# EAGLE design piHatMotorDriver (EAGLE 9.6.1)
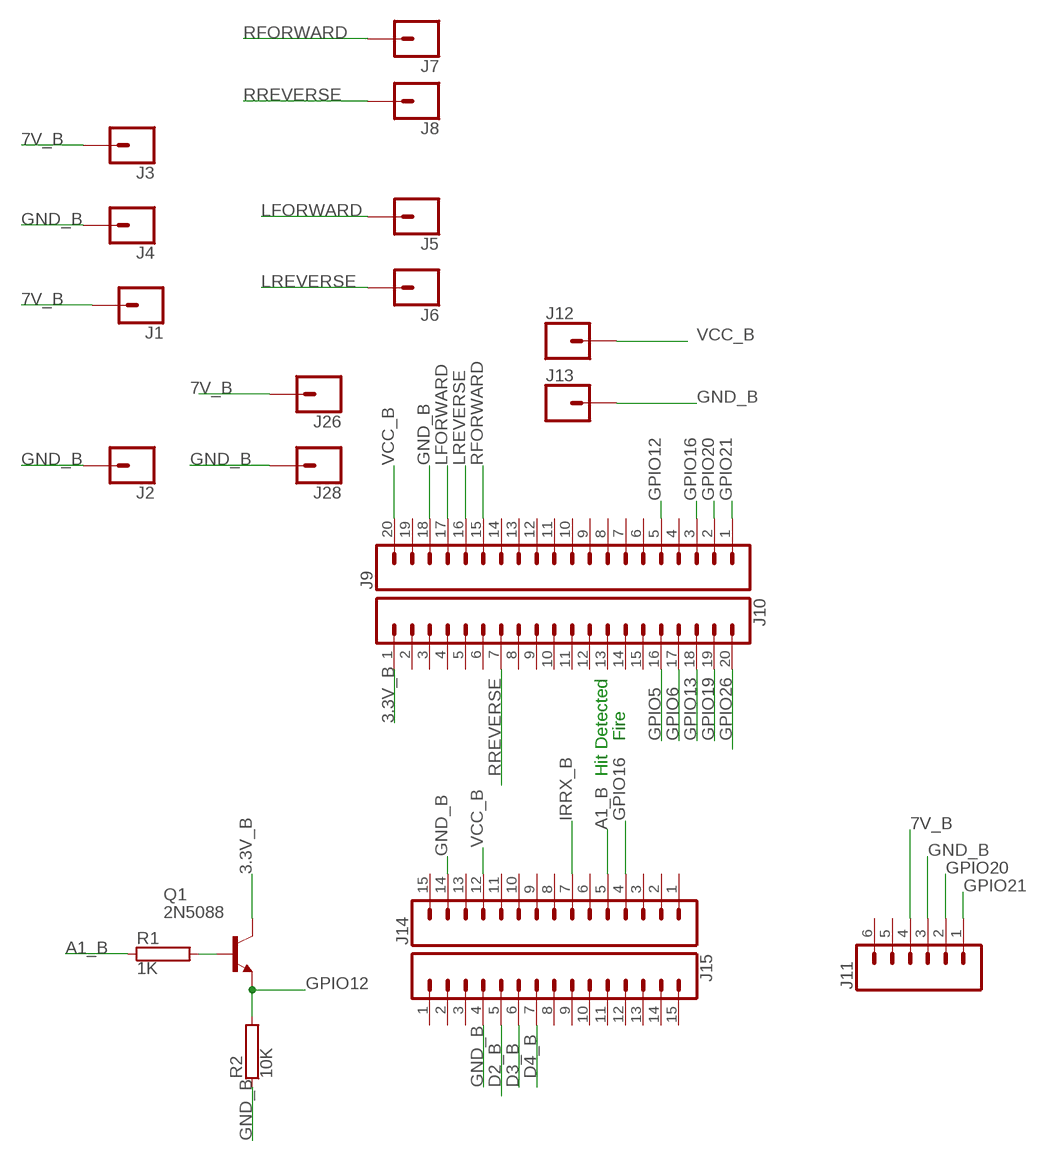
[diagram p0: schematic, sheet 1]

## Parts
J1  CONN_01  [1X01]
J2  CONN_01  [1X01]
J3  CONN_01  [1X01]
J4  CONN_01  [1X01]
J5  CONN_01  [1X01]
J6  CONN_01  [1X01]
J7  CONN_01  [1X01]
J8  CONN_01  [1X01]
J9  CONN_20  [1X20]
J10  CONN_20  [1X20]
J11  CONN_06SILK_FEMALE_PTH  [1X06]
J12  CONN_01  [1X01]
J13  CONN_01  [1X01]
J14  CONN_15  [1X15]
J15  CONN_15  [1X15]
J26  CONN_01  [1X01]
J28  CONN_01  [1X01]
Q1  2N5088  [TO92]
R1  1K  RCA0001  [CA0001]
R2  10K  RCA0001  [CA0001]

## Nets
3.3V_B: J10.1 Q1.1(C)
7V_B: J1.1 J3.1 J11.4 J26.1
A1_B: J14.5 R1.1
D2_B: J15.5
D3_B: J15.6
D4_B: J15.7
GND_B: J2.1 J4.1 J9.18 J11.3 J13.1 J14.14 J15.4 J28.1 R2.1
GPIO5: J10.16
GPIO6: J10.17
GPIO12: J9.5 Q1.3(E) R2.2
GPIO13: J10.18
GPIO16: J9.3 J14.4
GPIO19: J10.19
GPIO20: J9.2 J11.2
GPIO21: J9.1 J11.1
GPIO26: J10.20
IRRX_B: J14.7
LFORWARD: J5.1 J9.17
LREVERSE: J6.1 J9.16
N$1: Q1.2(B) R1.2
RFORWARD: J7.1 J9.15
RREVERSE: J8.1 J10.7
VCC_B: J9.20 J12.1 J14.12
Unconnected: J9.4 J9.6 J9.7 J9.8 J9.9 J9.10 J9.11 J9.12 J9.13 J9.14 J9.19 J10.2 J10.3 J10.4 J10.5 J10.6 J10.8 J10.9 J10.10 J10.11 J10.12 J10.13 J10.14 J10.15 J11.5 J11.6 J14.1 J14.2 J14.3 J14.6 J14.8 J14.9 J14.10 J14.11 J14.13 J14.15 J15.1 J15.2 J15.3 J15.8 J15.9 J15.10 J15.11 J15.12 J15.13 J15.14 J15.15

## Notes on the sheet
- Fire
- Hit Detected

## Library data of the parts
J1-J8 J12 J13 J26 J28 = SparkFun-Connectors:CONN_01: Single connection point. Often used as Generic Header-pin footprint for 0.1 inch spaced/style header connections On any of the 0.1 inch spaced packages, you can populate with these: Break Away Headers - Straight <https://www.sparkfun.com/products/116> (PRT-00116) Break Away Male Headers - Right Angle <https://www.sparkfun.com/products/553> (PRT-00553) Female Headers <https://www.sparkfun.com/products/115> (PRT-00115) Break Away Headers - Machine Pin <https://www.sparkfun.com/products/117> (PRT-00117) Break Away Female Headers - Swiss Machine Pin <https://www.sparkfun.com/products/743> (PRT-00743) This device is also useful as a general connection point to wire up your design to another part of your project. Our various solder wires solder well into these plated through hole pads. Hook-Up Wire - Assortment (Stranded, 22 AWG) <https://www.sparkfun.com/products/11375> (PRT-11375) Hook-Up Wire - Assortment (Solid Core, 22 AWG) <https://www.sparkfun.com/products/11367> (PRT-11367) View the entire wire category on our website here <https://www.sparkfun.com/categories/141> Special notes: SMTSO-256-ET is a "flush mount" nut for a 4-40 screw. We mostly use this on specialty testbeds; it is a nice way to connect hardware to your PCB at an adjustable hieght. Also note, the SNAP packages are for using a snappable style connector. We sell a baggie of snaps and they are also used on two LilyPad designs: Snap Assortment - 30 pack (male and female) <https://www.sparkfun.com/products/11347> (DEV-11347) LilyPad Arduino SimpleSnap <https://www.sparkfun.com/products/10941> (DEV-10941) LilyPad SimpleSnap Protoboard <https://www.sparkfun.com/products/10940> (DEV-10940)
J9 J10 = SparkFun-Connectors:CONN_20: Multi connection point. Often used as Generic Header-pin footprint for 0.1 inch spaced/style header connections On any of the 0.1 inch spaced packages, you can populate with these: Break Away Headers - Straight <https://www.sparkfun.com/products/116> (PRT-00116) Break Away Male Headers - Right Angle <https://www.sparkfun.com/products/553> (PRT-00553) Female Headers <https://www.sparkfun.com/products/115> (PRT-00115) Break Away Headers - Machine Pin <https://www.sparkfun.com/products/117> (PRT-00117) Break Away Female Headers - Swiss Machine Pin <https://www.sparkfun.com/products/743> (PRT-00743) For SCREWTERMINALS and SPRING TERMINALS visit here: Screw Terimnals on SparkFun.com <https://www.sparkfun.com/search/results?term=Screw+Terminals> (5mm/3.5mm/2.54mm spacing) This device is also useful as a general connection point to wire up your design to another part of your project. Our various solder wires solder well into these plated through hole pads. Hook-Up Wire - Assortment (Stranded, 22 AWG) <https://www.sparkfun.com/products/11375> (PRT-11375) Hook-Up Wire - Assortment (Solid Core, 22 AWG) <https://www.sparkfun.com/products/11367> (PRT-11367) View the entire wire category on our website here <https://www.sparkfun.com/categories/141> Special notes: Molex polarized connector foot print use with SKU : PRT-08231 with associated crimp pins and housings. 1MM SMD Version SKU: PRT-10208 NOTES ON THE VARIANTS LOCK and LOCK_LONGPADS... This footprint was designed to help hold the alignment of a through-hole component (i.e. 6-pin header) while soldering it into place. You may notice that each hole has been shifted either up or down by 0.005 of an inch from it's more standard position (which is a perfectly straight line). This slight alteration caused the pins (the squares in the middle) to touch the edges of the holes. Because they are alternating, it causes a "brace" to hold the component in place. 0.005 has proven to be the perfect amount of "off-center" position when using our standard breakaway headers. Although looks a little odd when you look at the bare footprint, once you have a header in there, the alteration is very hard to notice. Also,if you push a header all the way into place, it is covered up entirely on the bottom side. Note about LOCK SPECIAL package: This is just like the LOCK variant in that the holes are staggared by 5 mil, but except for the last two holes. They are not altered from the "standard" footprint layout. This is used for a special purpose on the layout of our Graphic LCD Backpack. Make sure you want to use this device before selecting it for you project!
J11 = SparkFun-Connectors:CONN_06: Multi connection point. Often used as Generic Header-pin footprint for 0.1 inch spaced/style header connections On any of the 0.1 inch spaced packages, you can populate with these: Break Away Headers - Straight <https://www.sparkfun.com/products/116> (PRT-00116) Break Away Male Headers - Right Angle <https://www.sparkfun.com/products/553> (PRT-00553) Female Headers <https://www.sparkfun.com/products/115> (PRT-00115) Break Away Headers - Machine Pin <https://www.sparkfun.com/products/117> (PRT-00117) Break Away Female Headers - Swiss Machine Pin <https://www.sparkfun.com/products/743> (PRT-00743) Arduino Stackable Header - 6 Pin <https://www.sparkfun.com/products/9280> (PRT-09280) For SCREWTERMINALS and SPRING TERMINALS visit here: Screw Terimnals on SparkFun.com <https://www.sparkfun.com/search/results?term=Screw+Terminals> (5mm/3.5mm/2.54mm spacing) This device is also useful as a general connection point to wire up your design to another part of your project. Our various solder wires solder well into these plated through hole pads. Hook-Up Wire - Assortment (Stranded, 22 AWG) <https://www.sparkfun.com/products/11375> (PRT-11375) Hook-Up Wire - Assortment (Solid Core, 22 AWG) <https://www.sparkfun.com/products/11367> (PRT-11367) View the entire wire category on our website here <https://www.sparkfun.com/categories/141>; PROD_ID: CONN-08437
J14 J15 = SparkFun-Connectors:CONN_15: Multi connection point. Often used as Generic Header-pin footprint for 0.1 inch spaced/style header connections On any of the 0.1 inch spaced packages, you can populate with these: Break Away Headers - Straight <https://www.sparkfun.com/products/116> (PRT-00116) Break Away Male Headers - Right Angle <https://www.sparkfun.com/products/553> (PRT-00553) Female Headers <https://www.sparkfun.com/products/115> (PRT-00115) Break Away Headers - Machine Pin <https://www.sparkfun.com/products/117> (PRT-00117) Break Away Female Headers - Swiss Machine Pin <https://www.sparkfun.com/products/743> (PRT-00743) For SCREWTERMINALS and SPRING TERMINALS visit here: Screw Terimnals on SparkFun.com <https://www.sparkfun.com/search/results?term=Screw+Terminals> (5mm/3.5mm/2.54mm spacing) This device is also useful as a general connection point to wire up your design to another part of your project. Our various solder wires solder well into these plated through hole pads. Hook-Up Wire - Assortment (Stranded, 22 AWG) <https://www.sparkfun.com/products/11375> (PRT-11375) Hook-Up Wire - Assortment (Solid Core, 22 AWG) <https://www.sparkfun.com/products/11367> (PRT-11367) View the entire wire category on our website here <https://www.sparkfun.com/categories/141> Special notes: Molex polarized connector foot print use with SKU : PRT-08231 with associated crimp pins and housings. 1MM SMD Version SKU: PRT-10208 NOTES ON THE VARIANTS LOCK and LOCK_LONGPADS... This footprint was designed to help hold the alignment of a through-hole component (i.e. 6-pin header) while soldering it into place. You may notice that each hole has been shifted either up or down by 0.005 of an inch from it's more standard position (which is a perfectly straight line). This slight alteration caused the pins (the squares in the middle) to touch the edges of the holes. Because they are alternating, it causes a "brace" to hold the component in place. 0.005 has proven to be the perfect amount of "off-center" position when using our standard breakaway headers. Although looks a little odd when you look at the bare footprint, once you have a header in there, the alteration is very hard to notice. Also,if you push a header all the way into place, it is covered up entirely on the bottom side.
Q1 = transistor-npn:2N5088: NPN Transistor
R1 R2 = resistor-power:R: Power Resitor; OC_FARNELL: unknown; OC_NEWARK: unknown

## Net classes
0 default: width 0.254 mm, clearance 0.254 mm
1 power: width 0.61 mm, drill 0.711 mm, clearance 0.33 mm
2 gnd: width 0.305 mm, drill 0.711 mm, clearance 0.254 mm
3 usbvcc: width 0.508 mm, drill 0.711 mm, clearance 0.254 mm
4 aref: width 0.406 mm

## Board
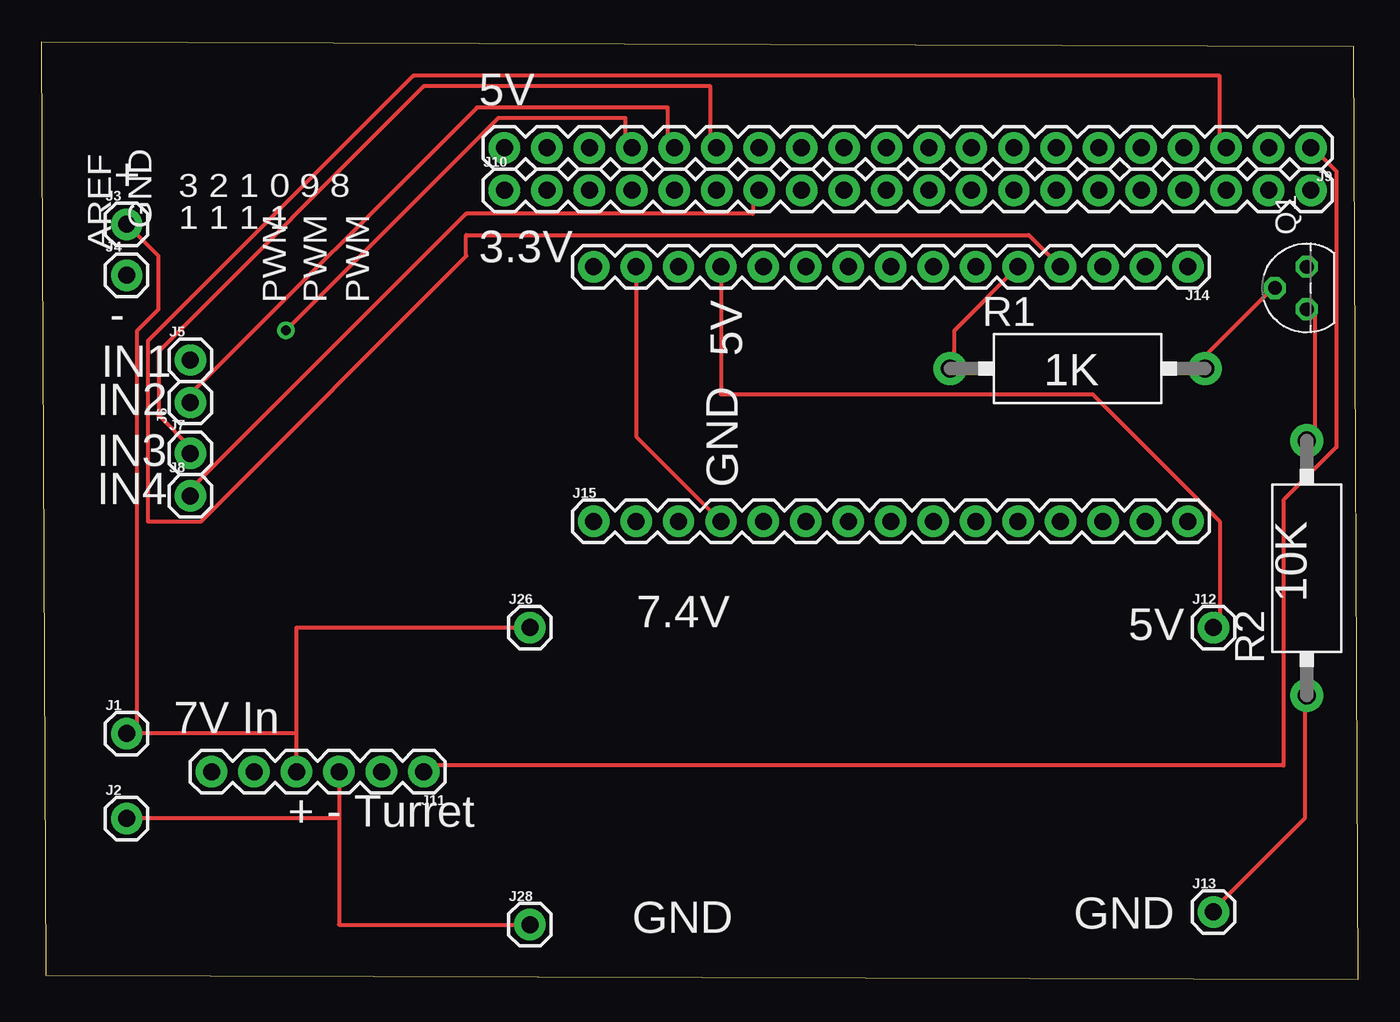
[diagram p1: board, top side]
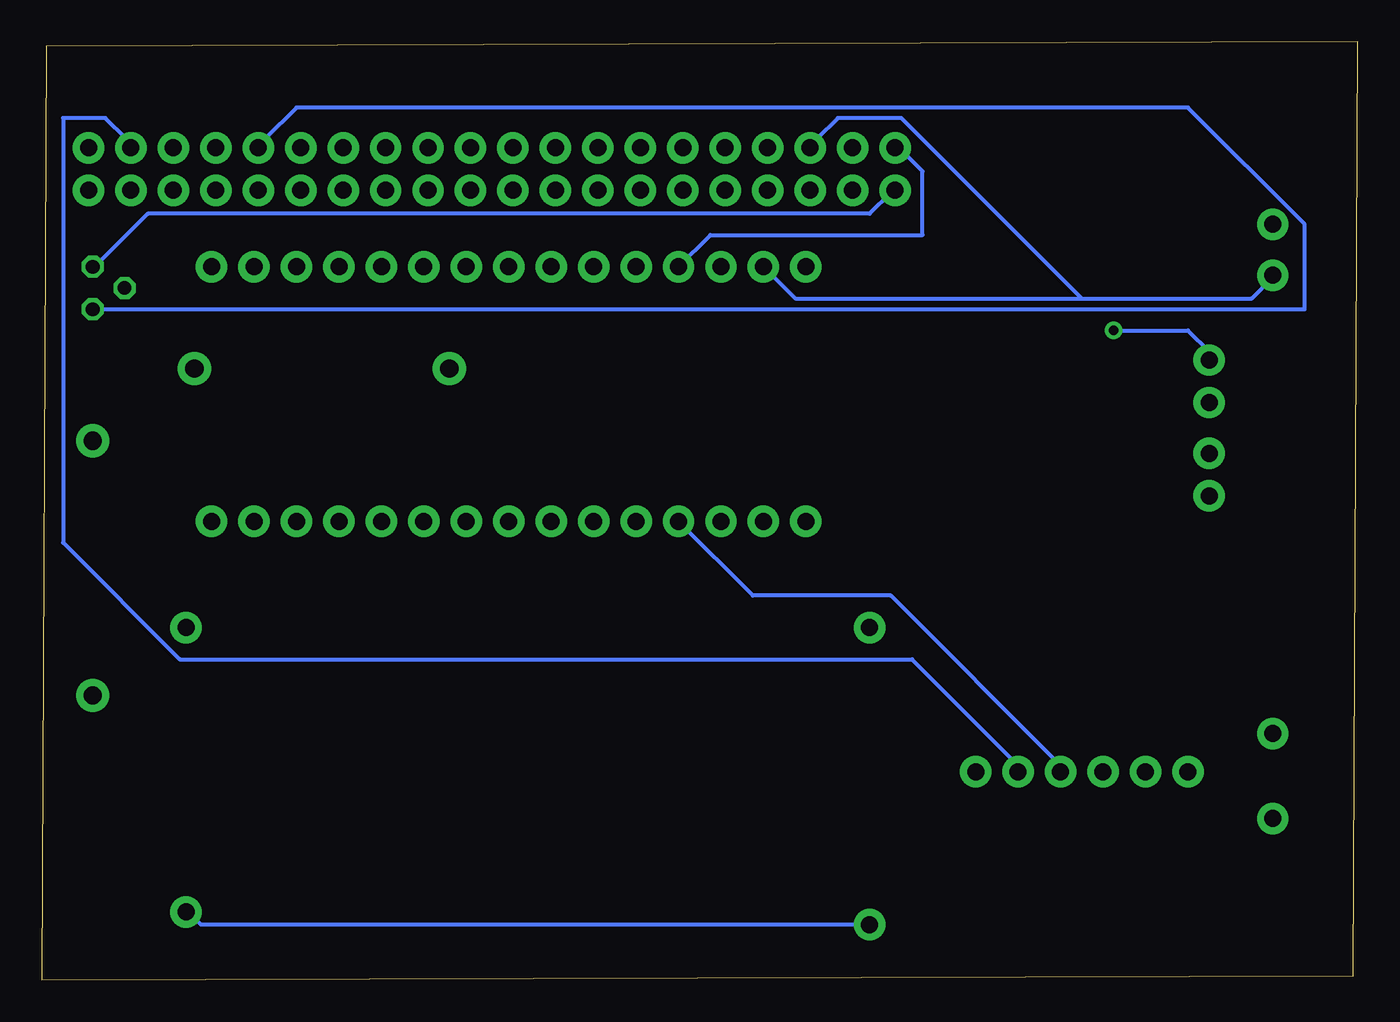
[diagram p2: board, bottom side, seen from below]

Size 78.74 x 56.13 mm. Coordinates in mm from the lower left corner, seen from the top.
Outline: 0,56.13 78.49,55.88 78.74,0 0.25,0.25 0,56.13
Copper layers (1*16): Top 0.035mm / dielectric 1.5mm / Bottom 0.035mm
Design rules "default": minimum track width 10mil, minimum drill 22mil, track to track 10mil, track to pad 10mil, pad to pad 10mil, via to via 16mil, smd to smd 8mil, copper to edge 30mil, drill to drill 12mil, minimum pad ring 10mil, minimum via ring 10mil, stop-mask expansion 4mil, vias tented up to drill 0mil, thermal gap 10mil
vRestrict: area 5.1,45 to 6.7,48.6; area 13.1,40.5 to 14.6,44.1; area 15.6,40.5 to 17.1,44.1; area 18.2,40.5 to 19.7,44.1; area 22.2,38.1 to 22.7,38.4

### Footprints (pad centres in the part's own frame; a part is rotated, then mirrored left to right if it is on the bottom)
1X01 = drill 1.016 pad 1.88: 1 0,0
1X20 = drill 1.016 pad 1.88: 1 0,0; 2 2.54,0; 3 5.08,0; 4 7.62,0; 5 10.16,0; 6 12.7,0; 7 15.24,0; 8 17.78,0; 9 20.32,0; 10 22.86,0; 11 25.4,0; 12 27.94,0; 13 30.48,0; 14 33.02,0; 15 35.56,0; 16 38.1,0; 17 40.64,0; 18 43.18,0; 19 45.72,0; 20 48.26,0
1X06 = drill 1.016 pad 1.88: 1 0,0; 2 2.54,0; 3 5.08,0; 4 7.62,0; 5 10.16,0; 6 12.7,0
1X15 = drill 1.016 pad 1.88: 1 0,0; 2 2.54,0; 3 5.08,0; 4 7.62,0; 5 10.16,0; 6 12.7,0; 7 15.24,0; 8 17.78,0; 9 20.32,0; 10 22.86,0; 11 25.4,0; 12 27.94,0; 13 30.48,0; 14 33.02,0; 15 35.56,0
TO92 = drill 0.813 octagon: 1 1.27,0; 2 0,1.905; 3 -1.27,0
CA0001 = drill 1.1 pad 2: 1 -7.62,0; 2 7.62,0

### Placement (x,y rotation side)
J1  5.08,14.73 0 top
J2  5.08,9.65 0 top
J3  5.08,45.21 0 top
J4  5.08,42.16 0 top
J5  8.89,37.08 0 top
J6  8.89,34.54 90 top
J7  8.89,31.5 0 top
J8  8.89,28.96 0 top
J9  75.95,49.78 180 top
J10  27.69,47.24 0 top
J11  22.86,12.45 180 top
J12  70.1,21.08 0 top
J13  70.1,4.06 0 top
J14  68.58,42.67 180 top
J15  33.02,27.43 0 top
J26  29.21,21.08 0 top
J28  29.21,3.3 0 top
Q1  75.69,41.4 90 top
R1  61.98,36.58 0 top
R2  75.69,24.64 90 top

### Tracks (layer width: path | path; a pad name or v marks a point on that pad's centre or on a via)
3.3V_B
  Bottom 0.254: Q1.1 75.56,42.67 72.39,45.85 29.21,45.85 27.94,47.12 J10.1
7V_B
  Top 0.254: 15.24,14.73 5.71,14.73 | J11.4 15.24,14.73 | J3.1 6.98,43.31 6.98,40.13 5.71,38.86 5.71,14.73 | 5.71,14.73 J1.1 | J26.1 15.24,21.08 15.24,14.73
A1_B
  Top 0.254: J14.5 54.61,38.86 54.61,36.96 R1.1
GND_B
  Top 0.254: J15.4 35.56,32.51 J14.14 | J13.1 70.49,4.57 75.56,9.65 75.56,16.64 R2.1 | 17.78,9.65 J2.1 | J11.3 17.78,9.65 | J28.1 17.78,3.3 17.78,9.65
  Bottom 0.254: 16.51,40.77 33.66,40.77 J14.14 | 16.51,40.77 6.35,40.77 5.08,42.04 J4.1 | 16.51,40.77 27.3,51.56 31.12,51.56 32.38,50.29 J9.18 | J28.1 69.22,3.3 69.85,3.94 J13.1 | J15.4 36.2,22.99 27.94,22.99 17.78,12.83 J11.3
GPIO12
  Top 0.254: Q1.3 76.2,40.13 76.2,32.51 R2.2
  Bottom 0.254: Q1.3 3.18,40.13 3.18,45.21 10.16,52.2 63.5,52.2 65.41,50.29 J9.5
GPIO16
  Top 0.254: J14.4 59.05,44.58 25.4,44.58 25.4,43.31 9.52,27.43 6.35,27.43 6.35,38.23 22.23,54.1 70.49,54.1 70.49,50.29 J9.3
GPIO20
  Bottom 0.254: J11.2 20.32,12.83 26.67,19.18 70.49,19.18 77.47,26.16 77.47,51.56 74.93,51.56 73.66,50.29 J9.2
GPIO21
  Top 0.254: J11.1 22.86,12.83 74.29,12.83 74.29,28.7 77.47,31.88 77.47,48.39 76.2,49.66 J9.1
LFORWARD  (via drill 0.56)
  Top 0.254: v14.6,38.86 27.3,51.56 34.92,51.56 34.92,50.29 J9.17
  Bottom 0.254: v14.6,38.86 10.16,38.86 8.89,37.59 J5.1
LREVERSE
  Top 0.254: J6.1 8.89,35.05 26.03,52.2 37.46,52.2 37.46,50.29 J9.16
N$1
  Top 0.254: Q1.2 73.66,41.4 69.85,37.59 69.85,36.96 R1.2
RFORWARD
  Top 0.254: J7.1 8.89,31.88 6.98,33.78 6.98,37.59 22.86,53.47 40.01,53.47 40.01,50.29 J9.15
RREVERSE
  Top 0.254: J8.1 8.89,29.34 25.4,45.85 42.55,45.85 42.55,47.12 J10.7
VCC_B
  Top 0.254: J14.12 40.64,35.05 62.87,35.05 70.49,27.43 70.49,21.08 J12.1
  Bottom 0.254: J14.12 38.73,44.58 26.03,44.58 26.03,48.39 27.3,49.66 J9.20

### Text on the board
tNames: 3 2 1 0 9 8 | GND | 1 1 1 1 | AREF | PWM | PWM | PWM | USB
Reference: C8 | C2 | R11 | C4 | C5
_tsilk: 5V | + | 3.3V | - | 5V | IN1 | 1K | IN2 | IN3 | GND | IN4 | 10K | 7.4V | 5V | 7V In | + - Turret | GND | GND